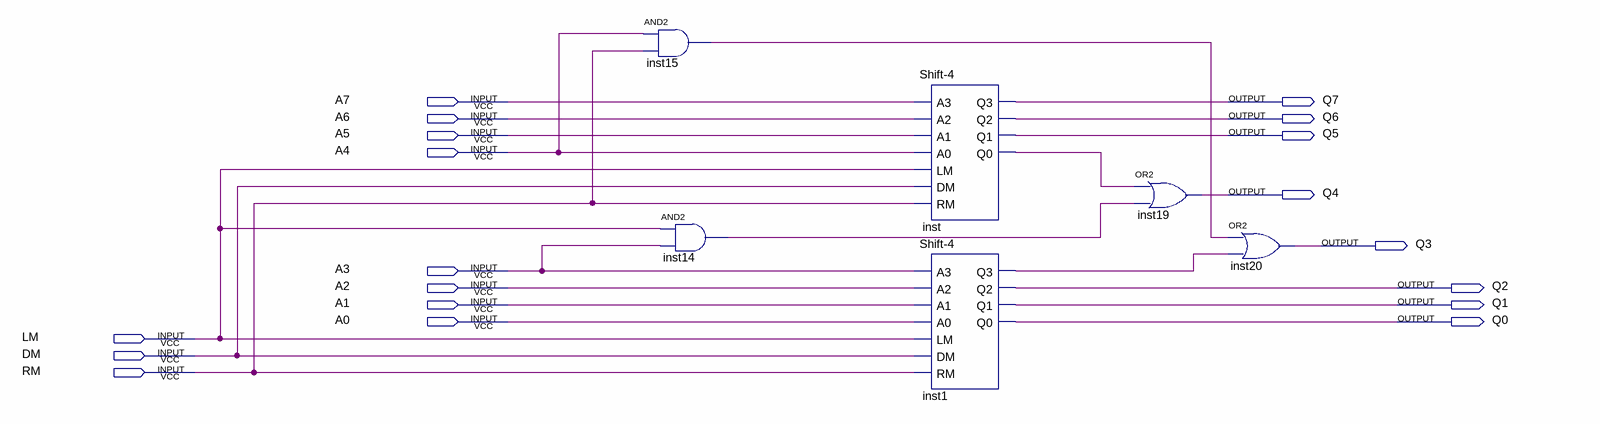
[diagram p0: schematic sheet]
// Quartus schematic Shift-8.bdf as structural Verilog: 6 symbols, 19 pins
module \Shift-8  (
  input  A7,
  input  A6,
  input  A5,
  input  A4,
  input  A3,
  input  A2,
  input  A1,
  input  A0,
  input  LM,
  input  DM,
  input  RM,
  output Q7,
  output Q6,
  output Q5,
  output Q4,
  output Q3,
  output Q2,
  output Q1,
  output Q0
);

  wire inst1_q3, inst14_out, inst15_out, inst_q0;

  and inst15 (inst15_out, A4, RM);
  and inst14 (inst14_out, LM, A3);
  \Shift-4  inst (
    .A3(A7), .A2(A6), .A1(A5), .A0(A4), .LM(LM), .DM(DM), .RM(RM), .Q3(Q7), .Q2(Q6), .Q1(Q5), .Q0(inst_q0));
  \Shift-4  inst1 (
    .A3(A3), .A2(A2), .A1(A1), .A0(A0), .LM(LM), .DM(DM), .RM(RM), .Q3(inst1_q3), .Q2(Q2), .Q1(Q1), .Q0(Q0));
  or inst19 (Q4, inst_q0, inst14_out);
  or inst20 (Q3, inst15_out, inst1_q3);
endmodule
